# Altium schematic sheet MAIN_BOARD.SchDoc
size C; SheetNumber: 1; SheetTotal: 9
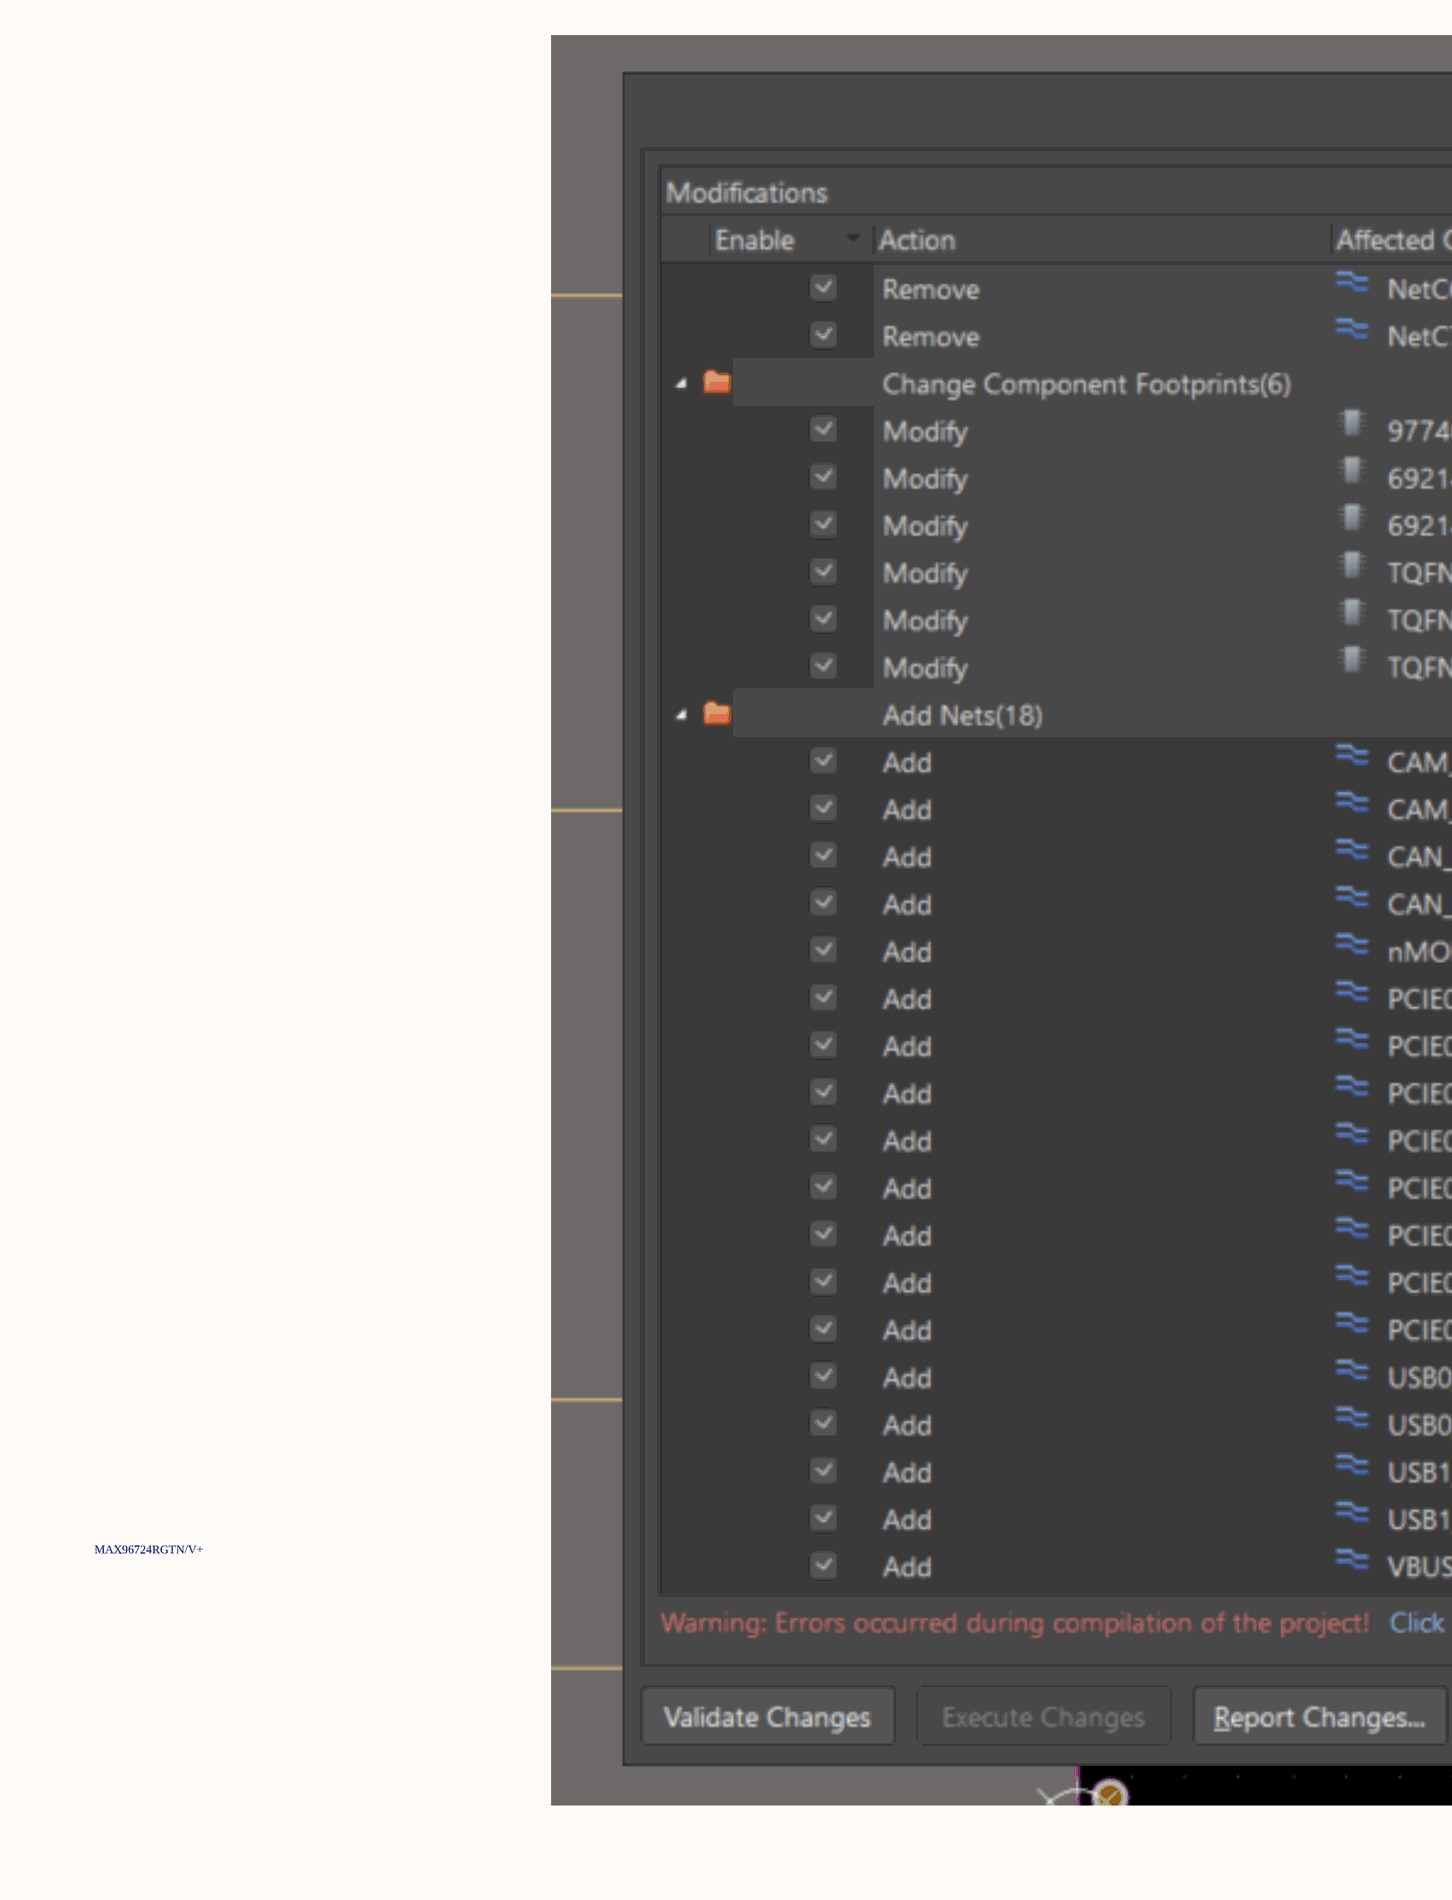
[diagram p0: MAIN_BOARD.SchDoc, top left]
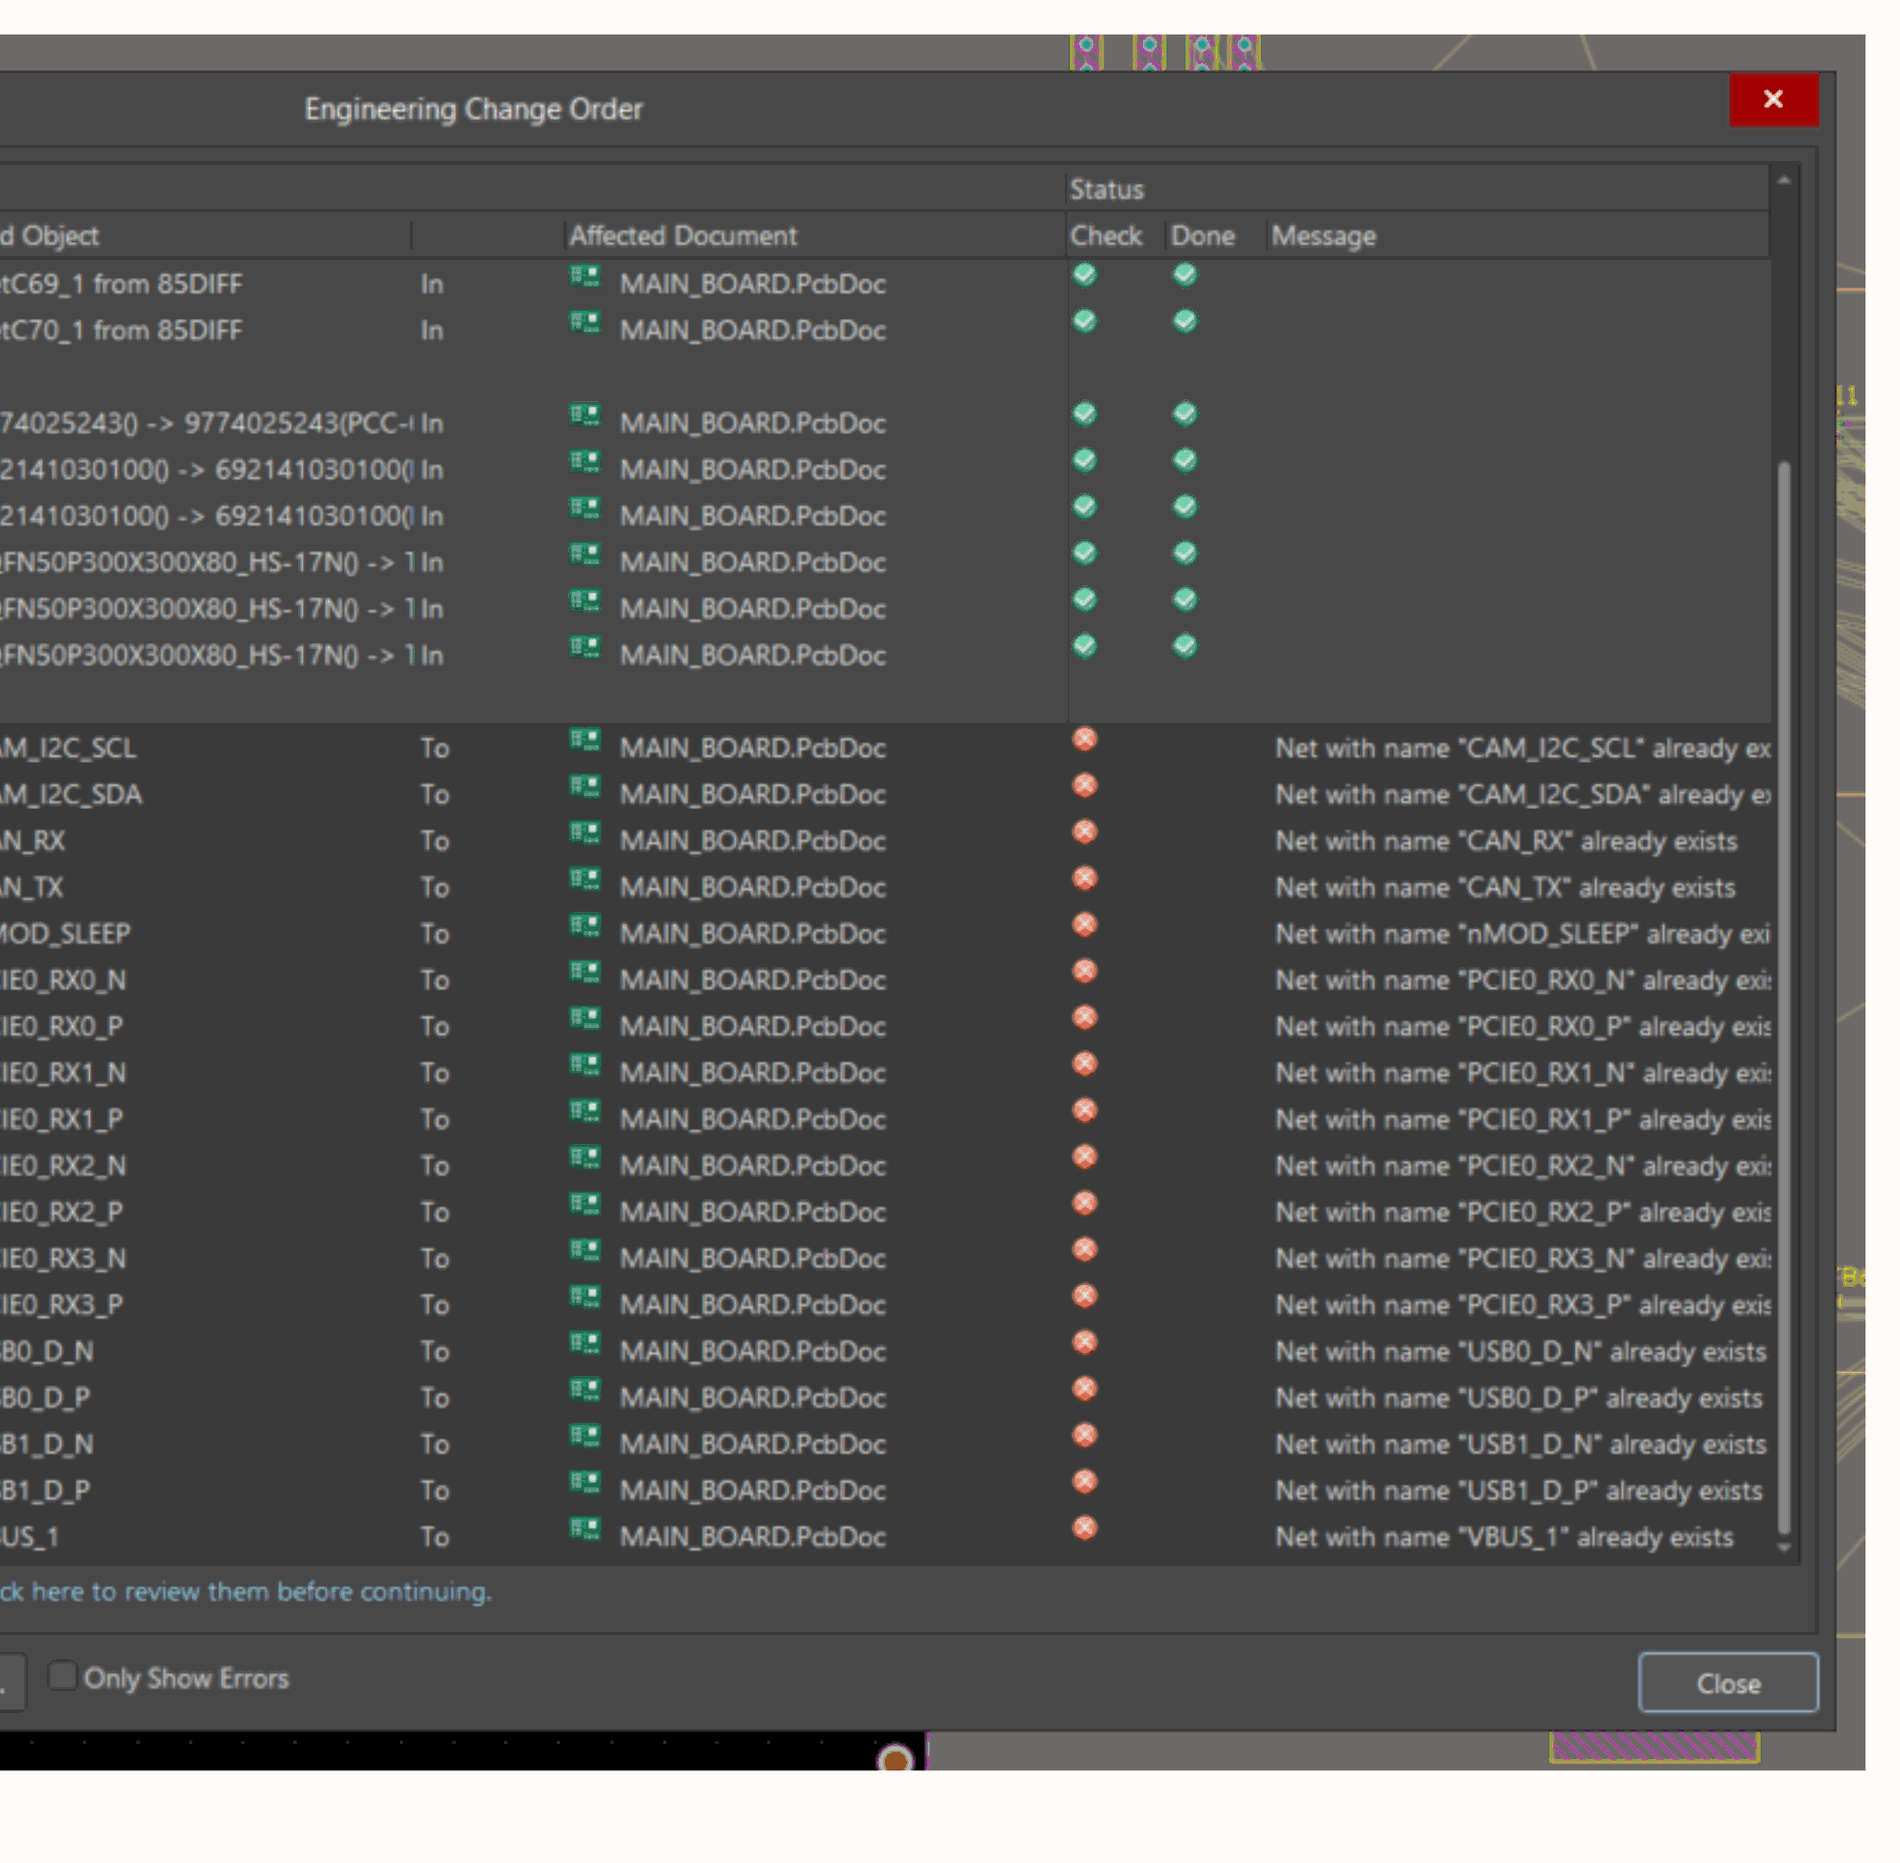
[diagram p1: MAIN_BOARD.SchDoc, top right]
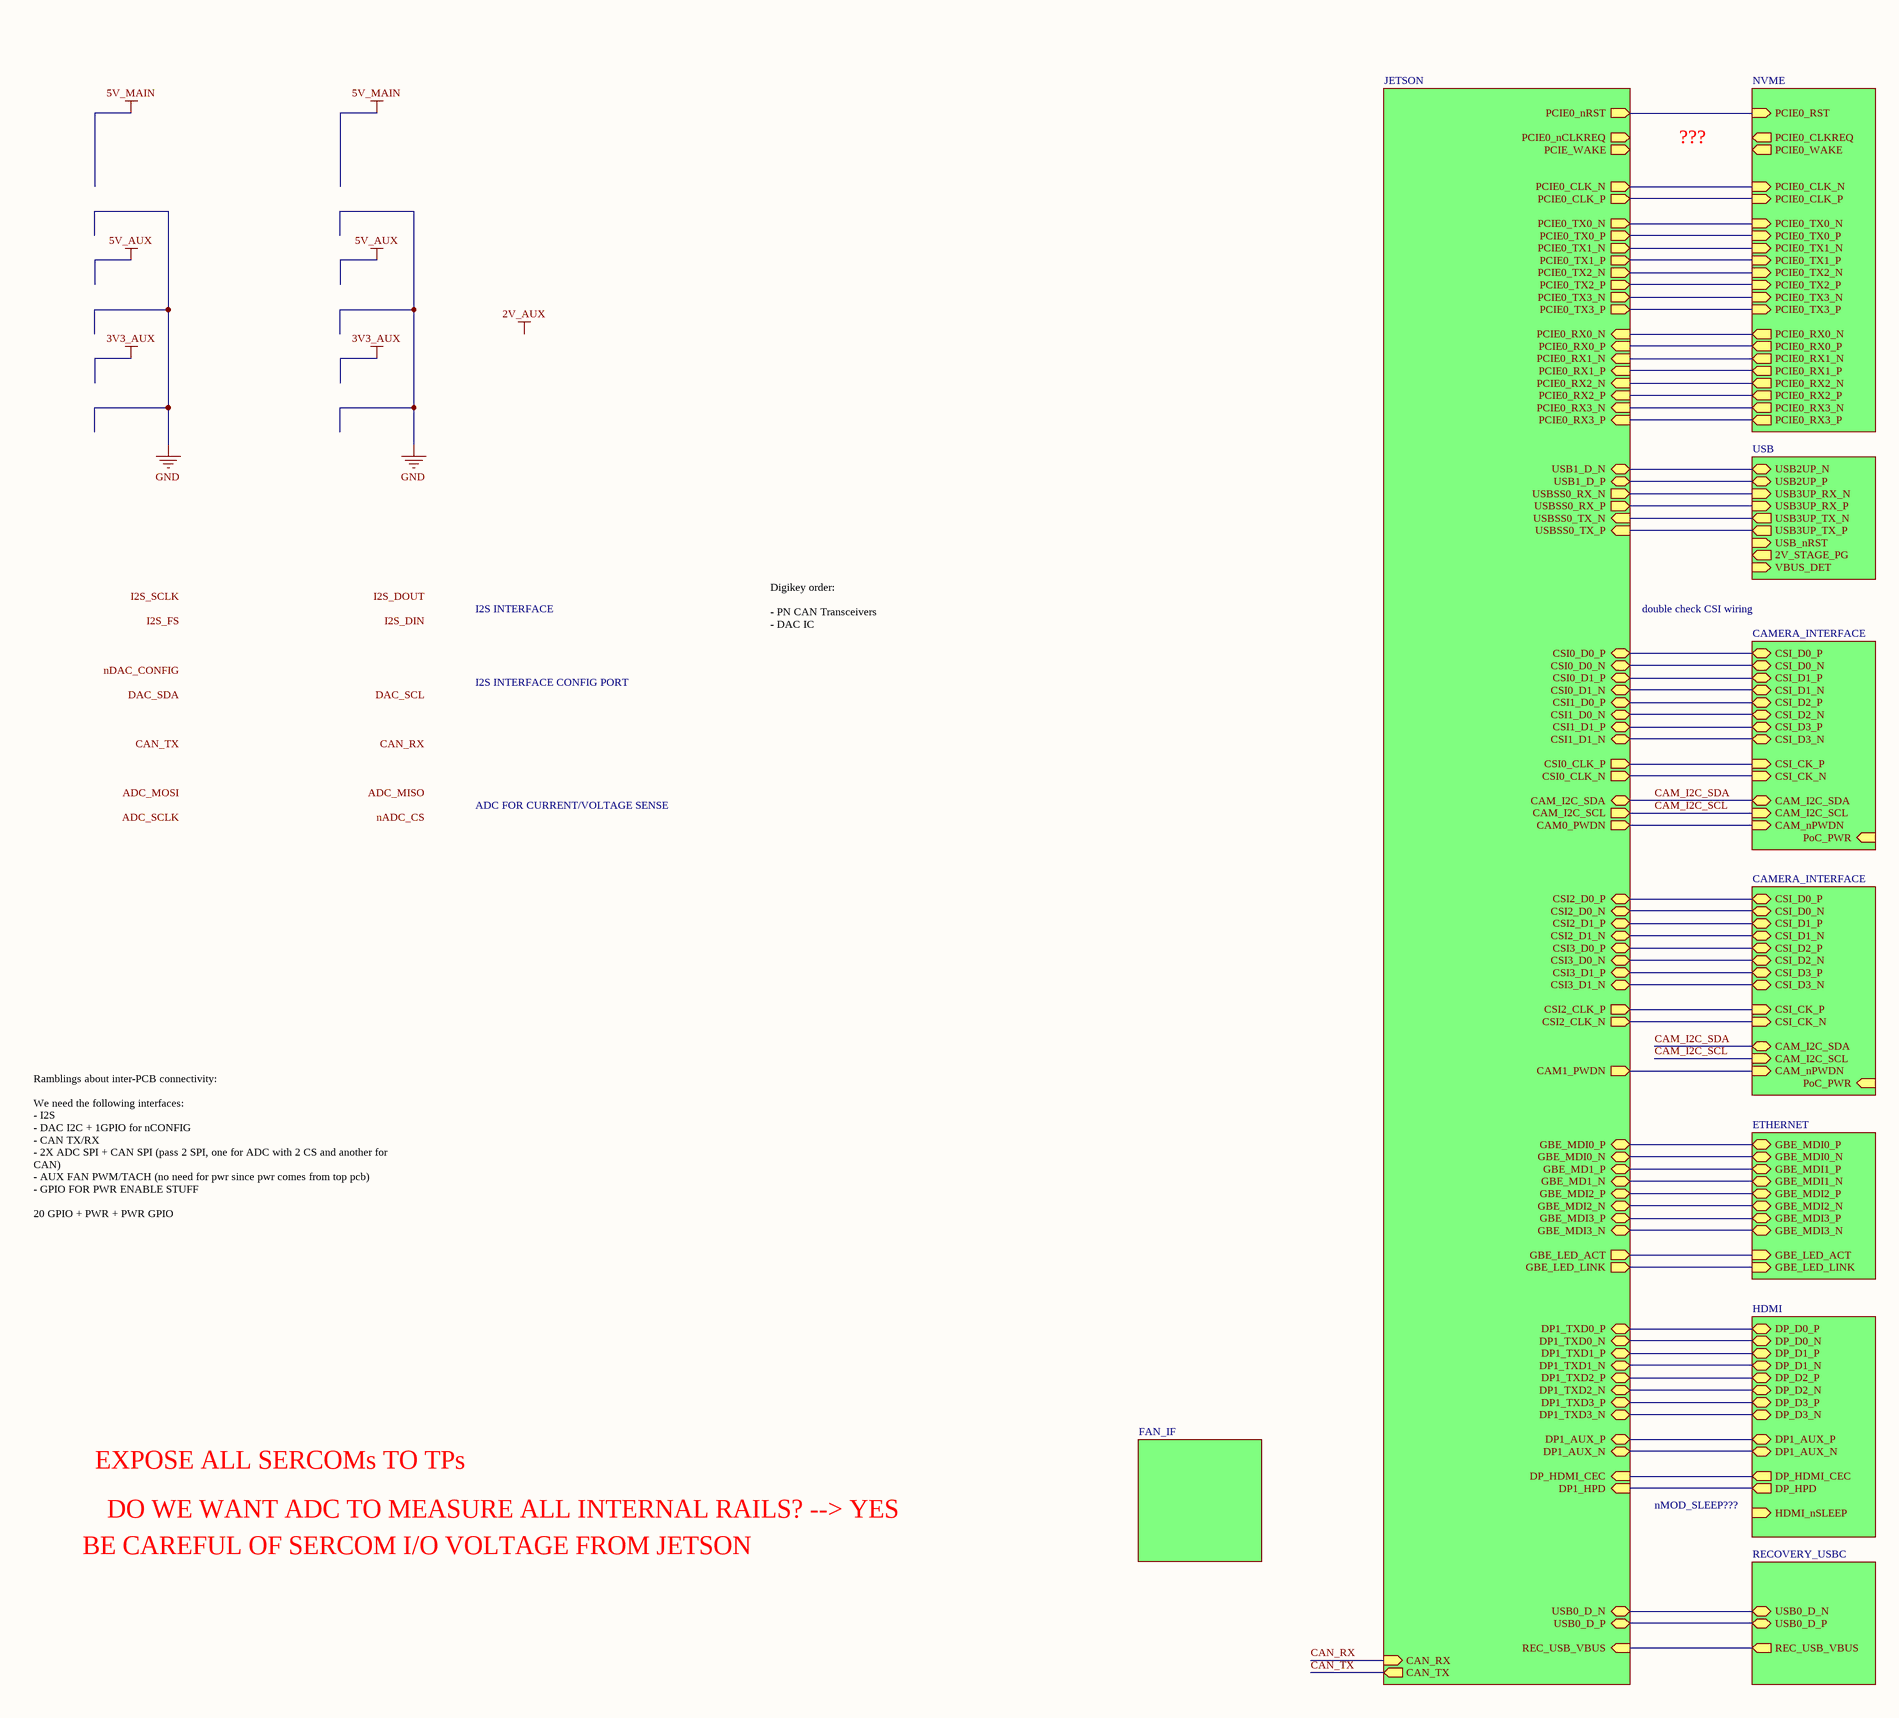
[diagram p2: MAIN_BOARD.SchDoc, bottom left]
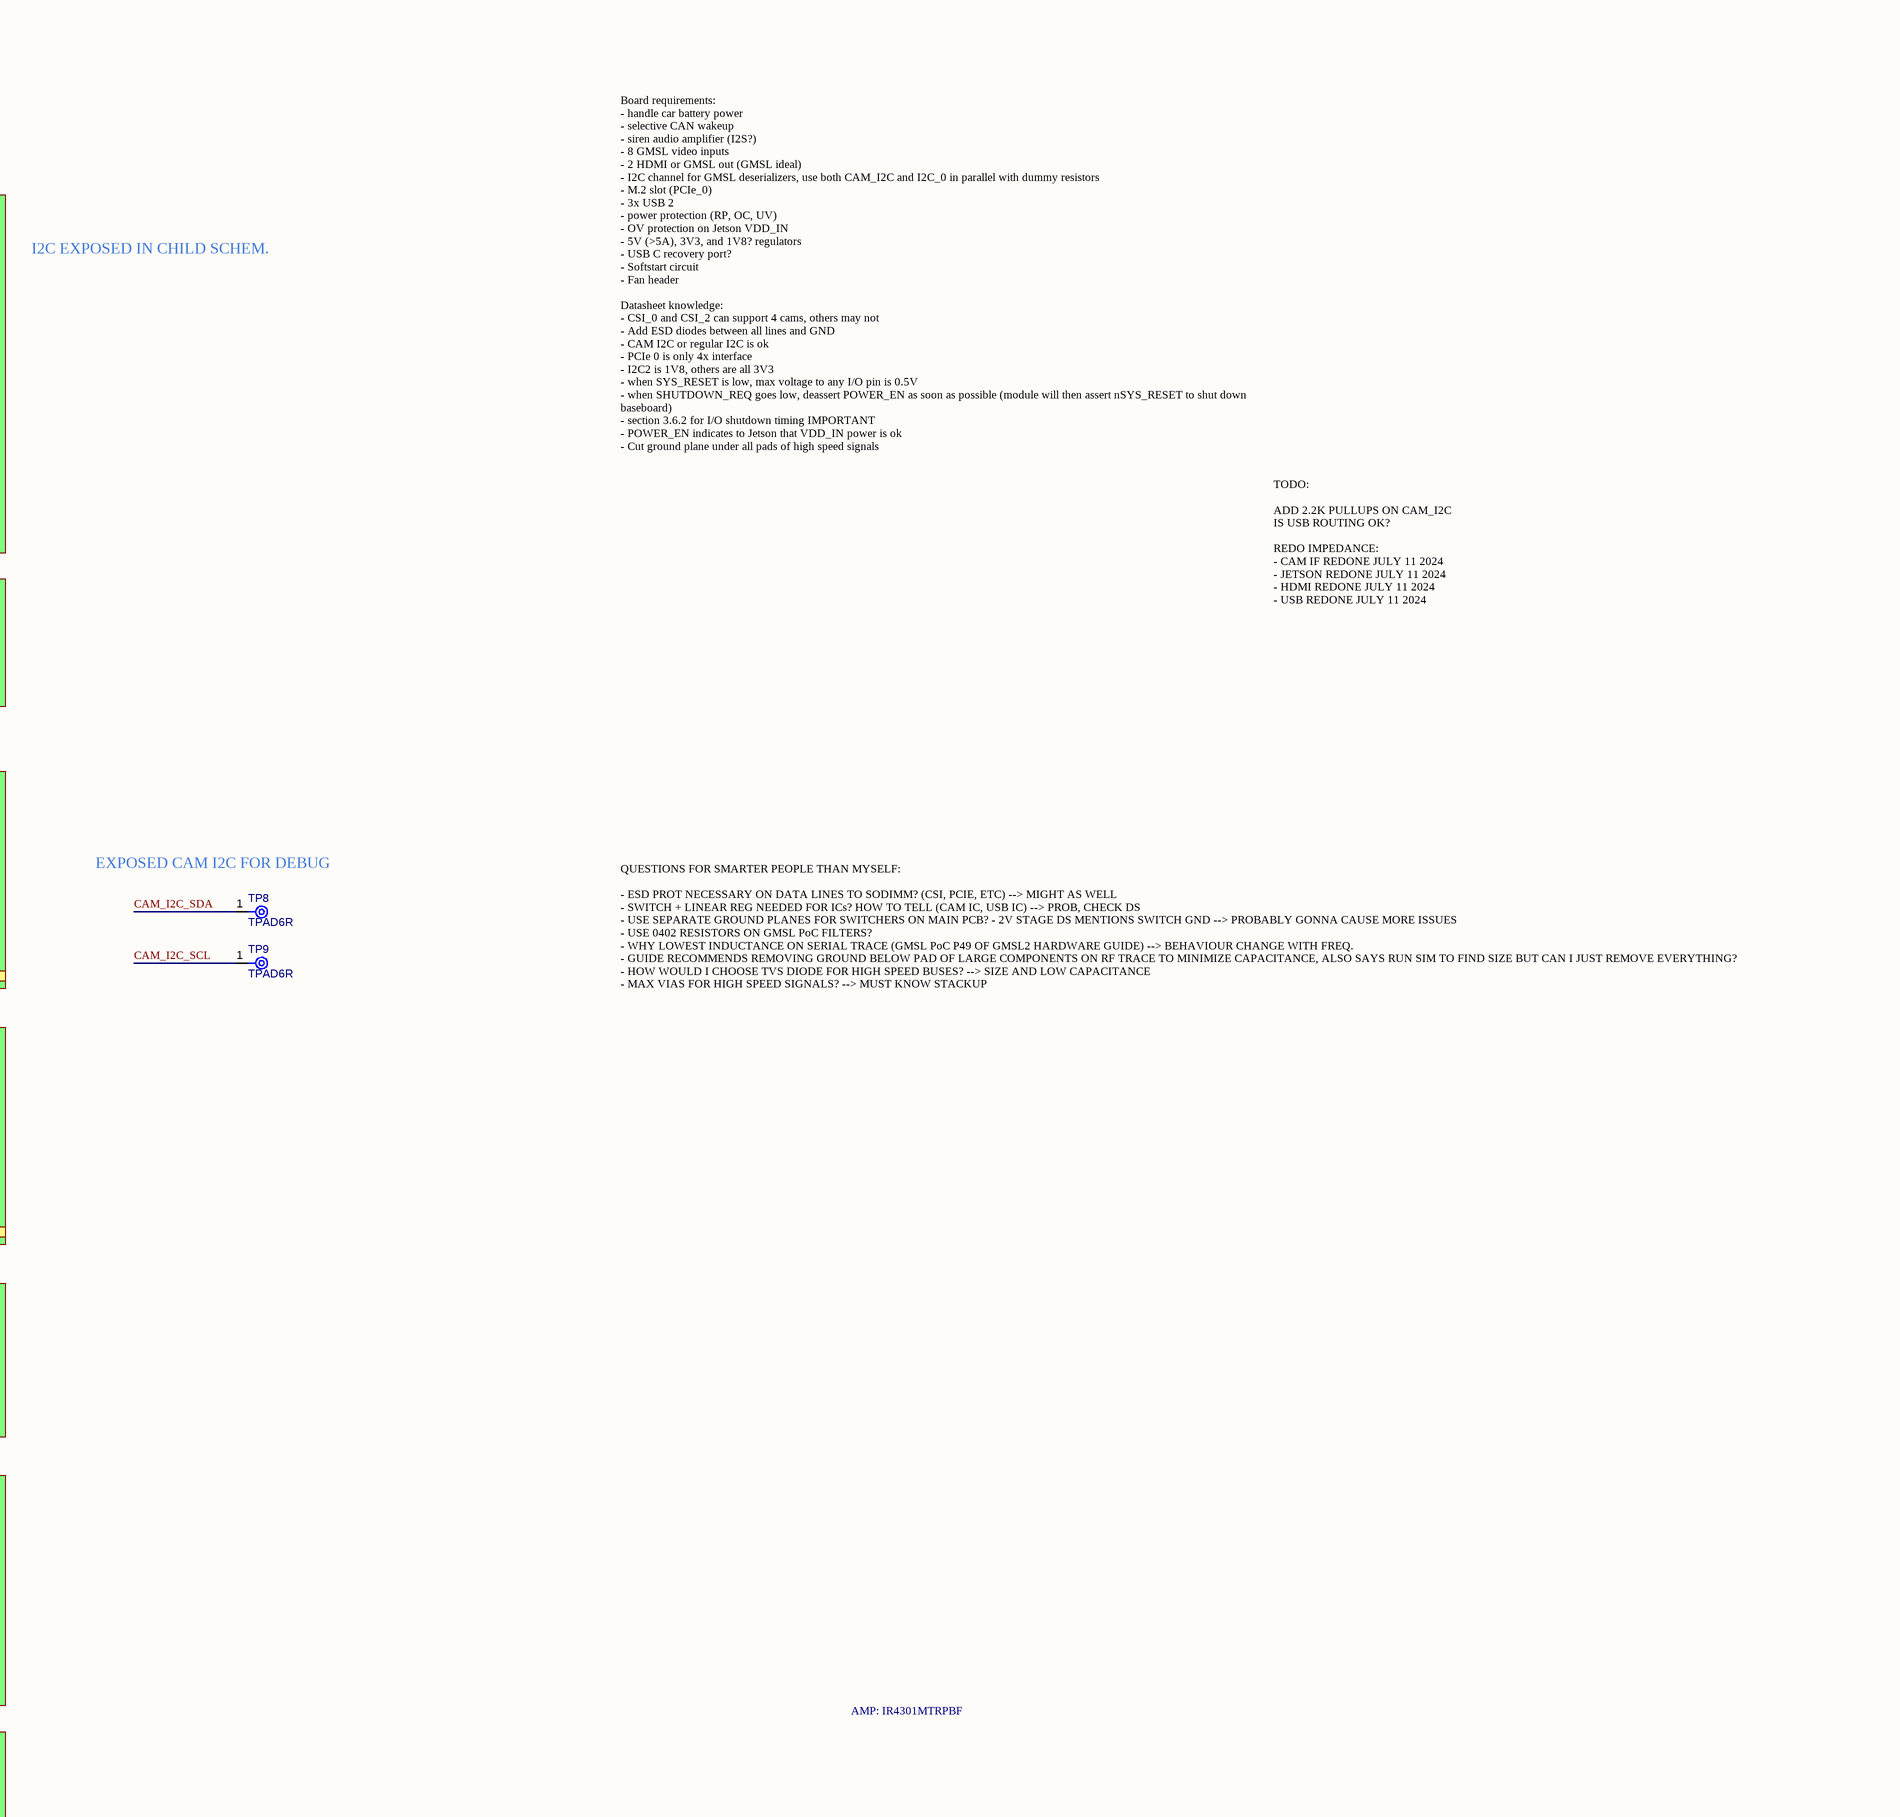
[diagram p3: MAIN_BOARD.SchDoc, bottom right]

## Parts
TP8  TPAD6R  [TP06R]  (no BOM)
TP9  TPAD6R  [TP06R]  (no BOM)

## Sub-sheets
CAMIF_1 = CAMERA_INTERFACE: CAM_I2C_SDA (bidir), CAM_I2C_SCL (in), CSI_D0_P (bidir), CSI_D0_N (bidir), CSI_D1_P (bidir), CSI_D1_N (bidir), CSI_CK_P (in), CSI_CK_N (in), CSI_D2_P (bidir), CSI_D2_N (bidir), CSI_D3_P (bidir), CSI_D3_N (bidir), PoC_PWR (in), CAM_nPWDN (in)
CAMIF_2 = CAMERA_INTERFACE: CAM_I2C_SDA (bidir), CAM_I2C_SCL (in), CSI_D0_P (bidir), CSI_D0_N (bidir), CSI_D1_P (bidir), CSI_D1_N (bidir), CSI_D2_P (bidir), CSI_D2_N (bidir), CSI_D3_P (bidir), CSI_D3_N (bidir), CSI_CK_P (in), CSI_CK_N (in), PoC_PWR (in), CAM_nPWDN (in)
ETH0 = ETHERNET: GBE_MDI0_P (bidir), GBE_MDI0_N (bidir), GBE_MDI1_P (bidir), GBE_MDI1_N (bidir), GBE_MDI2_P (bidir), GBE_MDI2_N (bidir), GBE_MDI3_P (bidir), GBE_MDI3_N (bidir), GBE_LED_ACT (in), GBE_LED_LINK (in)
FAN_IF = FAN_IF: no entries
HDMI_0 = HDMI: HDMI_nSLEEP (in), DP_D0_P (bidir), DP_D0_N (bidir), DP_D1_P (bidir), DP_D1_N (bidir), DP_D2_P (bidir), DP_D2_N (bidir), DP_D3_P (bidir), DP_D3_N (bidir), DP1_AUX_P (bidir), DP1_AUX_N (bidir), DP_HDMI_CEC (out), DP_HPD (out)
JETSON = JETSON: PCIE0_RX0_N (in), PCIE0_RX0_P (in), PCIE0_RX1_N (in), PCIE0_RX1_P (in), PCIE0_RX2_N (in), PCIE0_RX2_P (in), PCIE0_RX3_N (in), PCIE0_RX3_P (in), PCIE0_TX0_N (out), PCIE0_TX0_P (out), PCIE0_TX1_N (out), PCIE0_TX1_P (out), PCIE0_TX2_N (out), PCIE0_TX2_P (out), PCIE0_TX3_N (out), PCIE0_TX3_P (out), PCIE0_CLK_N (out), PCIE0_CLK_P (out), USBSS0_TX_N (in), USBSS0_TX_P (in), USBSS0_RX_N (out), USBSS0_RX_P (out), USB1_D_N (bidir), USB1_D_P (bidir), CSI2_D0_N (bidir), CSI2_D0_P (bidir), CSI2_CLK_N (out), CSI2_CLK_P (out), CSI2_D1_N (bidir), CSI2_D1_P (bidir), CSI0_D0_N (bidir), CSI0_D0_P (bidir), CSI0_CLK_N (out), CSI0_CLK_P (out), CSI0_D1_N (bidir), CSI0_D1_P (bidir), CAM_I2C_SCL (out), CAM_I2C_SDA (bidir), CSI1_D0_N (bidir), CSI1_D0_P (bidir), CSI1_D1_N (bidir), CSI1_D1_P (bidir), CSI3_D0_N (bidir), CSI3_D0_P (bidir), CSI3_D1_N (bidir), CSI3_D1_P (bidir), GBE_MDI0_N (bidir), GBE_MDI0_P (bidir), GBE_MD1_N (bidir), GBE_MD1_P (bidir), GBE_MDI2_N (bidir), GBE_MDI2_P (bidir), GBE_MDI3_N (bidir), GBE_MDI3_P (bidir), GBE_LED_ACT (out), GBE_LED_LINK (out), DP1_TXD0_N (bidir), DP1_TXD0_P (bidir), DP1_TXD1_N (bidir), DP1_TXD1_P (bidir), DP1_TXD2_N (bidir), DP1_TXD2_P (bidir), DP1_TXD3_N (bidir), DP1_TXD3_P (bidir), DP1_AUX_N (bidir), DP1_AUX_P (bidir), DP_HDMI_CEC (in), DP1_HPD (in), USB0_D_N (bidir), USB0_D_P (bidir), PCIE_WAKE (out), PCIE0_nCLKREQ (out), PCIE0_nRST (out), CAM0_PWDN (out), CAM1_PWDN (out), CAN_RX (in), CAN_TX (out), REC_USB_VBUS (in)
NVME = NVME: PCIE0_RST (in), PCIE0_CLKREQ (out), PCIE0_WAKE (out), PCIE0_CLK_N (in), PCIE0_CLK_P (in), PCIE0_TX3_N (in), PCIE0_TX3_P (in), PCIE0_TX2_N (in), PCIE0_TX2_P (in), PCIE0_TX1_N (in), PCIE0_TX1_P (in), PCIE0_TX0_N (in), PCIE0_TX0_P (in), PCIE0_RX3_N (out), PCIE0_RX3_P (out), PCIE0_RX2_N (out), PCIE0_RX2_P (out), PCIE0_RX1_N (out), PCIE0_RX1_P (out), PCIE0_RX0_N (out), PCIE0_RX0_P (out)
REC_USB = RECOVERY_USBC: USB0_D_N (bidir), USB0_D_P (bidir), REC_USB_VBUS (out)
USB3_0 = USB: USB2UP_N (bidir), USB2UP_P (bidir), USB3UP_RX_N (in), USB3UP_RX_P (in), USB3UP_TX_N (out), USB3UP_TX_P (out), VBUS_DET (in), USB_nRST (in), 2V_STAGE_PG (out)

## Nets
CAM_I2C_SCL: TP9.1(TP) ; sheet JETSON/CAM_I2C_SCL, sheet CAMIF_1/CAM_I2C_SCL, sheet CAMIF_2/CAM_I2C_SCL
CAM_I2C_SDA: TP8.1(TP) ; sheet JETSON/CAM_I2C_SDA, sheet CAMIF_1/CAM_I2C_SDA, sheet CAMIF_2/CAM_I2C_SDA
CAN_RX: sheet JETSON/CAN_RX
CAN_TX: sheet JETSON/CAN_TX
(unnamed): sheet JETSON/PCIE0_RX0_N, sheet NVME/PCIE0_RX0_N
(unnamed): sheet JETSON/PCIE0_RX0_P, sheet NVME/PCIE0_RX0_P
(unnamed): sheet JETSON/PCIE0_RX1_N, sheet NVME/PCIE0_RX1_N
(unnamed): sheet JETSON/PCIE0_RX1_P, sheet NVME/PCIE0_RX1_P
(unnamed): sheet JETSON/PCIE0_RX2_N, sheet NVME/PCIE0_RX2_N
(unnamed): sheet JETSON/PCIE0_RX2_P, sheet NVME/PCIE0_RX2_P
(unnamed): sheet JETSON/PCIE0_RX3_N, sheet NVME/PCIE0_RX3_N
(unnamed): sheet JETSON/PCIE0_RX3_P, sheet NVME/PCIE0_RX3_P
(unnamed): sheet JETSON/PCIE0_TX0_N, sheet NVME/PCIE0_TX0_N
(unnamed): sheet JETSON/PCIE0_TX0_P, sheet NVME/PCIE0_TX0_P
(unnamed): sheet JETSON/PCIE0_TX1_N, sheet NVME/PCIE0_TX1_N
(unnamed): sheet JETSON/PCIE0_TX1_P, sheet NVME/PCIE0_TX1_P
(unnamed): sheet JETSON/PCIE0_TX2_N, sheet NVME/PCIE0_TX2_N
(unnamed): sheet JETSON/PCIE0_TX2_P, sheet NVME/PCIE0_TX2_P
(unnamed): sheet JETSON/PCIE0_TX3_N, sheet NVME/PCIE0_TX3_N
(unnamed): sheet JETSON/PCIE0_TX3_P, sheet NVME/PCIE0_TX3_P
(unnamed): sheet JETSON/PCIE0_CLK_N, sheet NVME/PCIE0_CLK_N
(unnamed): sheet JETSON/PCIE0_CLK_P, sheet NVME/PCIE0_CLK_P
(unnamed): sheet JETSON/USBSS0_TX_N, sheet USB3_0/USB3UP_TX_N
(unnamed): sheet JETSON/USBSS0_TX_P, sheet USB3_0/USB3UP_TX_P
(unnamed): sheet JETSON/USBSS0_RX_N, sheet USB3_0/USB3UP_RX_N
(unnamed): sheet JETSON/USBSS0_RX_P, sheet USB3_0/USB3UP_RX_P
(unnamed): sheet JETSON/USB1_D_N, sheet USB3_0/USB2UP_N
(unnamed): sheet JETSON/USB1_D_P, sheet USB3_0/USB2UP_P
(unnamed): sheet JETSON/CSI2_D0_N, sheet CAMIF_2/CSI_D0_N
(unnamed): sheet JETSON/CSI2_D0_P, sheet CAMIF_2/CSI_D0_P
(unnamed): sheet JETSON/CSI2_CLK_N, sheet CAMIF_2/CSI_CK_N
(unnamed): sheet JETSON/CSI2_CLK_P, sheet CAMIF_2/CSI_CK_P
(unnamed): sheet JETSON/CSI2_D1_N, sheet CAMIF_2/CSI_D1_N
(unnamed): sheet JETSON/CSI2_D1_P, sheet CAMIF_2/CSI_D1_P
(unnamed): sheet JETSON/CSI0_D0_N, sheet CAMIF_1/CSI_D0_N
(unnamed): sheet JETSON/CSI0_D0_P, sheet CAMIF_1/CSI_D0_P
(unnamed): sheet JETSON/CSI0_CLK_N, sheet CAMIF_1/CSI_CK_N
(unnamed): sheet JETSON/CSI0_CLK_P, sheet CAMIF_1/CSI_CK_P
(unnamed): sheet JETSON/CSI0_D1_N, sheet CAMIF_1/CSI_D1_N
(unnamed): sheet JETSON/CSI0_D1_P, sheet CAMIF_1/CSI_D1_P
(unnamed): sheet JETSON/CSI1_D0_N, sheet CAMIF_1/CSI_D2_N
(unnamed): sheet JETSON/CSI1_D0_P, sheet CAMIF_1/CSI_D2_P
(unnamed): sheet JETSON/CSI1_D1_N, sheet CAMIF_1/CSI_D3_N
(unnamed): sheet JETSON/CSI1_D1_P, sheet CAMIF_1/CSI_D3_P
(unnamed): sheet JETSON/CSI3_D0_N, sheet CAMIF_2/CSI_D2_N
(unnamed): sheet JETSON/CSI3_D0_P, sheet CAMIF_2/CSI_D2_P
(unnamed): sheet JETSON/CSI3_D1_N, sheet CAMIF_2/CSI_D3_N
(unnamed): sheet JETSON/CSI3_D1_P, sheet CAMIF_2/CSI_D3_P
(unnamed): sheet JETSON/GBE_MDI0_N, sheet ETH0/GBE_MDI0_N
(unnamed): sheet JETSON/GBE_MDI0_P, sheet ETH0/GBE_MDI0_P
(unnamed): sheet JETSON/GBE_MD1_N, sheet ETH0/GBE_MDI1_N
(unnamed): sheet JETSON/GBE_MD1_P, sheet ETH0/GBE_MDI1_P
(unnamed): sheet JETSON/GBE_MDI2_N, sheet ETH0/GBE_MDI2_N
(unnamed): sheet JETSON/GBE_MDI2_P, sheet ETH0/GBE_MDI2_P
(unnamed): sheet JETSON/GBE_MDI3_N, sheet ETH0/GBE_MDI3_N
(unnamed): sheet JETSON/GBE_MDI3_P, sheet ETH0/GBE_MDI3_P
(unnamed): sheet JETSON/GBE_LED_ACT, sheet ETH0/GBE_LED_ACT
(unnamed): sheet JETSON/GBE_LED_LINK, sheet ETH0/GBE_LED_LINK
(unnamed): sheet JETSON/DP1_TXD0_N, sheet HDMI_0/DP_D0_N
(unnamed): sheet JETSON/DP1_TXD0_P, sheet HDMI_0/DP_D0_P
(unnamed): sheet JETSON/DP1_TXD1_N, sheet HDMI_0/DP_D1_N
(unnamed): sheet JETSON/DP1_TXD1_P, sheet HDMI_0/DP_D1_P
(unnamed): sheet JETSON/DP1_TXD2_N, sheet HDMI_0/DP_D2_N
(unnamed): sheet JETSON/DP1_TXD2_P, sheet HDMI_0/DP_D2_P
(unnamed): sheet JETSON/DP1_TXD3_N, sheet HDMI_0/DP_D3_N
(unnamed): sheet JETSON/DP1_TXD3_P, sheet HDMI_0/DP_D3_P
(unnamed): sheet JETSON/DP1_AUX_N, sheet HDMI_0/DP1_AUX_N
(unnamed): sheet JETSON/DP1_AUX_P, sheet HDMI_0/DP1_AUX_P
(unnamed): sheet JETSON/DP_HDMI_CEC, sheet HDMI_0/DP_HDMI_CEC
(unnamed): sheet JETSON/DP1_HPD, sheet HDMI_0/DP_HPD
(unnamed): sheet JETSON/USB0_D_N, sheet REC_USB/USB0_D_N
(unnamed): sheet JETSON/USB0_D_P, sheet REC_USB/USB0_D_P
(unnamed): sheet JETSON/PCIE0_nRST, sheet NVME/PCIE0_RST
(unnamed): sheet JETSON/CAM0_PWDN, sheet CAMIF_1/CAM_nPWDN
(unnamed): sheet JETSON/CAM1_PWDN, sheet CAMIF_2/CAM_nPWDN
(unnamed): sheet JETSON/REC_USB_VBUS, sheet REC_USB/REC_USB_VBUS

## Notes on the sheet
- MAX96724RGTN/V+
- ???
- I2C EXPOSED IN CHILD SCHEM.
- Board requirements:
  - handle car battery power
  - selective CAN wakeup
  - siren audio amplifier (I2S?)
  - 8 GMSL video inputs
  - 2 HDMI or GMSL out (GMSL ideal)
  - I2C channel for GMSL deserializers, use both CAM_I2C and I2C_0 in parallel with dummy resistors
  - M.2 slot (PCIe_0)
  - 3x USB 2
  - power protection (RP, OC, UV)
  - OV protection on Jetson VDD_IN
  - 5V (>5A), 3V3, and 1V8? regulators
  - USB C recovery port?
  - Softstart circuit
  - Fan header
  Datasheet knowledge:
  - CSI_0 and CSI_2 can support 4 cams, others may not
  - Add ESD diodes between all lines and GND
  - CAM I2C or regular I2C is ok
  - PCIe 0 is only 4x interface
  - I2C2 is 1V8, others are all 3V3
  - when SYS_RESET is low, max voltage to any I/O pin is 0.5V
  - when SHUTDOWN_REQ goes low, deassert POWER_EN as soon as possible (module will then assert nSYS_RESET to shut down baseboard)
  - section 3.6.2 for I/O shutdown timing IMPORTANT
  - POWER_EN indicates to Jetson that VDD_IN power is ok
  - Cut ground plane under all pads of high speed signals
- I2S INTERFACE
- double check CSI wiring
- I2S INTERFACE CONFIG PORT
- TODO:
  ADD 2.2K PULLUPS ON CAM_I2C
  IS USB ROUTING OK?
  REDO IMPEDANCE:
  - CAM IF REDONE JULY 11 2024
  - JETSON REDONE JULY 11 2024
  - HDMI REDONE JULY 11 2024
  - USB REDONE JULY 11 2024
- (near TP8) EXPOSED CAM I2C FOR DEBUG
- ADC FOR CURRENT/VOLTAGE SENSE
- Digikey order:
  - PN CAN Transceivers
  - DAC IC
- QUESTIONS FOR SMARTER PEOPLE THAN MYSELF:
  - ESD PROT NECESSARY ON DATA LINES TO SODIMM? (CSI, PCIE, ETC) --> MIGHT AS WELL
  - SWITCH + LINEAR REG NEEDED FOR ICs? HOW TO TELL (CAM IC, USB IC) --> PROB, CHECK DS
  - USE SEPARATE GROUND PLANES FOR SWITCHERS ON MAIN PCB? - 2V STAGE DS MENTIONS SWITCH GND --> PROBABLY GONNA CAUSE MORE ISSUES
  - USE 0402 RESISTORS ON GMSL PoC FILTERS?
  - WHY LOWEST INDUCTANCE ON SERIAL TRACE (GMSL PoC P49 OF GMSL2 HARDWARE GUIDE) --> BEHAVIOUR CHANGE WITH FREQ.
  - GUIDE RECOMMENDS REMOVING GROUND BELOW PAD OF LARGE COMPONENTS ON RF TRACE TO MINIMIZE CAPACITANCE, ALSO SAYS RUN SIM TO FIND SIZE BUT CAN I JUST REMOVE EVERYTHING?
  - HOW WOULD I CHOOSE TVS DIODE FOR HIGH SPEED BUSES? --> SIZE AND LOW CAPACITANCE
  - MAX VIAS FOR HIGH SPEED SIGNALS? --> MUST KNOW STACKUP
- Ramblings about inter-PCB connectivity:
  We need the following interfaces:
  - I2S
  - DAC I2C + 1GPIO for nCONFIG
  - CAN TX/RX
  - 2X ADC SPI + CAN SPI (pass 2 SPI, one for ADC with 2 CS and another for CAN)
  - AUX FAN PWM/TACH (no need for pwr since pwr comes from top pcb)
  - GPIO FOR PWR ENABLE STUFF
  20 GPIO + PWR + PWR GPIO
- EXPOSE ALL SERCOMs TO TPs
- DO WE WANT ADC TO MEASURE ALL INTERNAL RAILS? --> YES
- nMOD_SLEEP???
- BE CAREFUL OF SERCOM I/O VOLTAGE FROM JETSON
- AMP: IR4301MTRPBF
- Labels drawn without touching a wire or pin: 2V_AUX, ADC_MISO, ADC_MOSI, ADC_SCLK, CAN_RX, CAN_TX, DAC_SCL, DAC_SDA, I2S_DIN, I2S_DOUT, I2S_FS, I2S_SCLK, nADC_CS, nDAC_CONFIG

## Library data of the parts
TP8 TP9 = CMP-00028-00002-2: 0.6mm round; Pins: 1